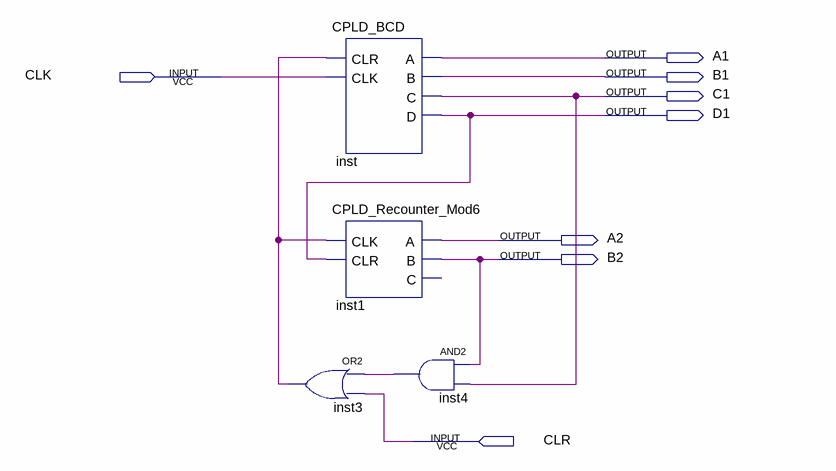
[diagram p0: schematic sheet]
// Quartus schematic CPLD_Counter_Mod24.bdf as structural Verilog: 4 symbols, 8 pins
module CPLD_Counter_Mod24 (
  input  CLK,
  input  CLR,
  output A1,
  output B1,
  output C1,
  output D1,
  output A2,
  output B2
);

  wire inst3_out, inst4_out;

  or inst3 (inst3_out, inst4_out, CLR);
  CPLD_BCD inst (.CLR(inst3_out), .CLK(CLK), .A(A1), .B(B1), .C(C1), .D(D1));
  CPLD_Recounter_Mod6 inst1 (.CLK(inst3_out), .CLR(D1), .A(A2), .B(B2));  // open: C
  and inst4 (inst4_out, B2, C1);
endmodule
